# Altium schematic sheet Current_Sensor.SchDoc
size A4; SheetNumber: 1; SheetTotal: 5
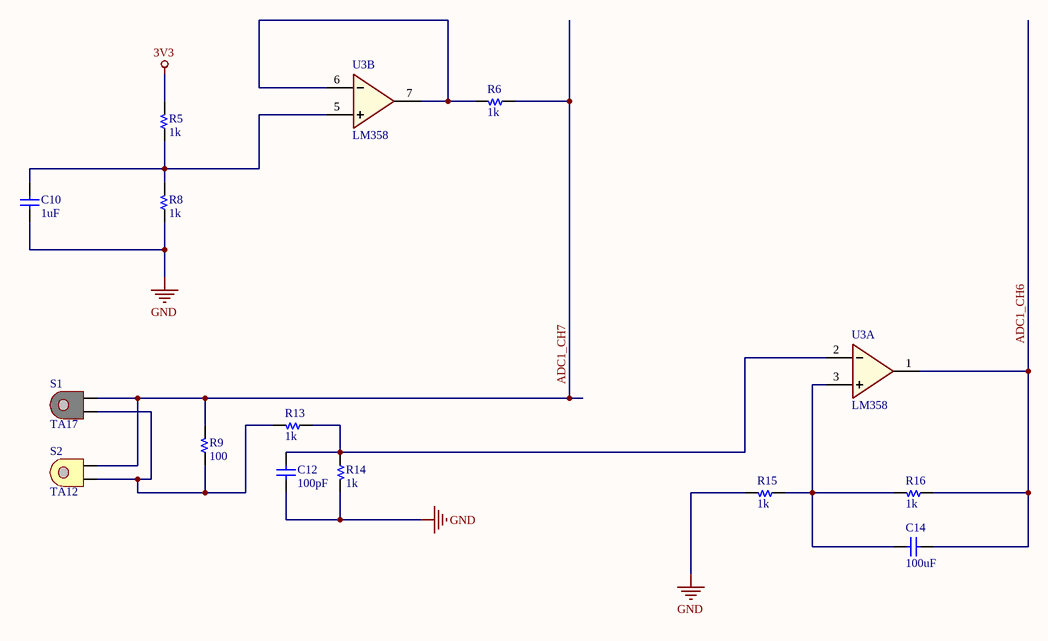
[diagram p0: Current_Sensor.SchDoc]

## Parts
C10  1uF  [C 0805]
C12  100pF  [C 0805]
C14  100uF  [C 0805]
R5  1k  [R 0805]
R6  1k  [R 0805]
R8  1k  [R 0805]
R9  100  [R 0805]
R13  1k  [R 0805]
R14  1k  [R 0805]
R15  1k  [R 0805]
R16  1k  [R 0805]
S1  TA17  [TA17]
S2  TA12  [TA12]
U3  LM358  [SOIC-8]  (parts A,B of 2)

## Nets
3V3: R5.2
GND: C10.2 C12.2 R8.1 R14.2 R15.2 U3.4(GND)
VCC: U3.8(VCC)
ADC1_CH6: C14.2 R16.1 U3.1(OutA)
ADC1_CH7: R6.1 R9.2 S1.2 S2.2
NetC10_1: C10.1 R5.1 R8.2 U3.5(B+)
NetC12_1: C12.1 R13.1 R14.1 U3.2(A-)
NetC14_1: C14.1 R15.1 R16.2 U3.3(A+)
NetR6_2: R6.2 U3.6(B-) U3.7(OutB)
NetR9_1: R9.1 R13.2 S1.1 S2.1

## Library data of the parts
C10 C12 C14 = Capacitor NP: Capacitor non-pol
R5 R6 R8 R9 R13-R16 = Resistor
U3 = LM358: Low Power Dual Operational Amplifiers